# Altium schematic sheet 01.Main.SchDoc
size A
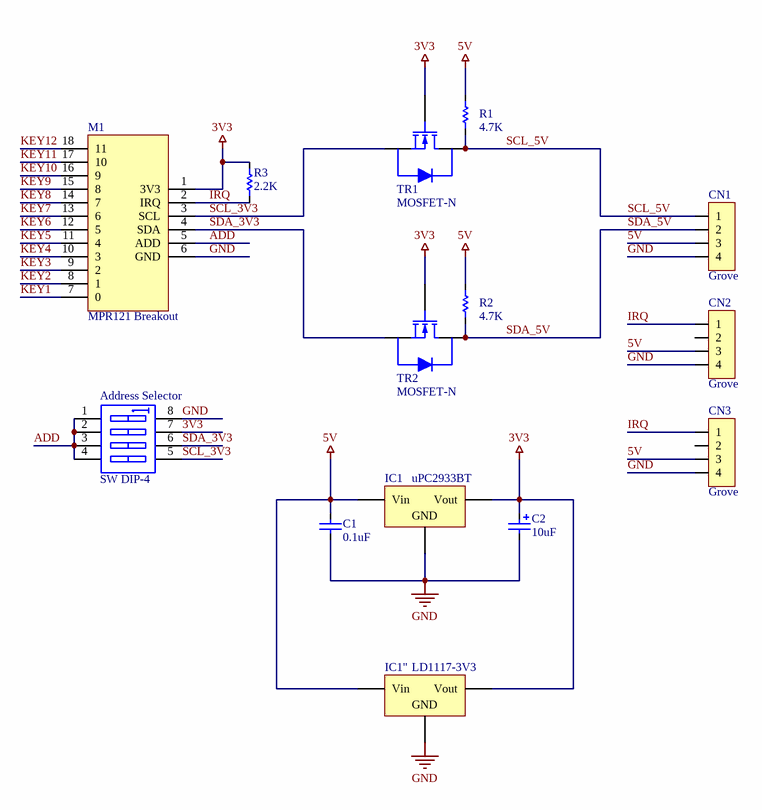
[diagram p0: 01.Main.SchDoc]

## Parts
Address_Selector  SW DIP-4  [DIP-8]
C1  0.1uF  [Cap NP 5mm]
C2  10uF  [Cap 5mm]
CN1  Grove  [Grove-4P-180D]
CN2  Grove  [Grove-4P-180D]
CN3  Grove  [Grove-4P-180D]
IC1  uPC2933BT  [D2PAK_M]
IC1"  LD1117-3V3  [sot223_M]
M1  MPR121 Breakout  [MPR121 Breakout]
R1  4.7K  [Res 1/4W]
R2  4.7K  [Res 1/4W]
R3  2.2K  [0805]
TR1  MOSFET-N  [to-92]
TR2  MOSFET-N  [to-92]

## Nets
3V3: Address_Selector.7(B2) C2.1 IC1.Vout IC1".Vout M1.1(3V3) R3.2 TR1.2(G) TR2.2(G)
5V: C1.2 CN1.3 CN2.3 CN3.3 IC1.Vin IC1".Vin R1.2 R2.2
GND: Address_Selector.8(B1) C1.1 C2.2 CN1.4 CN2.4 CN3.4 IC1.GND IC1".GND M1.6(GND)
ADD: Address_Selector.1(A1) Address_Selector.2(A2) Address_Selector.3(A3) Address_Selector.4(A4) M1.5(ADD)
IRQ: CN2.1 CN3.1 M1.2(IRQ) R3.1
KEY1: M1.7(0)
KEY2: M1.8(1)
KEY3: M1.9(2)
KEY4: M1.10(3)
KEY5: M1.11(4)
KEY6: M1.12(5)
KEY7: M1.13(6)
KEY8: M1.14(7)
KEY9: M1.15(8)
KEY10: M1.16(9)
KEY11: M1.17(10)
KEY12: M1.18(11)
SCL_3V3: Address_Selector.5(B4) M1.3(SCL) TR1.1(S)
SCL_5V: CN1.1 R1.1 TR1.3(D)
SDA_3V3: Address_Selector.6(B3) M1.4(SDA) TR2.1(S)
SDA_5V: CN1.2 R2.1 TR2.3(D)

Not connected (* = marked no-connect by the designer): CN2 2; CN3 2

## Library data of the parts
Address_Selector = SW DIP-4: DIP Switch, 4 Position, SPST; Published: 24-Mar-1999; LatestRevisionDate: 29-May-2009; LatestRevisionNote: IPC-7351 Footprint Added.; PackageVersion: Dec-2002; PackageReference: SO8; Publisher: Altium Limited; PackageDescription: 8-Pin Small Outline Integrated Circuit 1.27 mm Pitch; Code_JEDEC: MS-012-AA; Code_IPC: SOIC127P600-8
C1 = Capacitor Non-Polar
C2 = Capacitor Polar
CN1-CN3 = Connector 1X4
IC1 IC1" = Volt Reg_1: Voltage Regulator; Published: 24-Mar-1999; LatestRevisionDate: 29-May-2009; LatestRevisionNote: IPC-7351 Footprint Added.; PackageReference: D2PAK; Publisher: Altium Limited; PackageDescription: 3-Pin Transistor Outline Package 2.54 mm Pitch, 15.1 mm Lead Span
R1-R3 = Resistor
TR1 TR2 = MOSFET-N: N-Channel MOSFET; Published: 8-Jun-2000; LatestRevisionDate: 17-Jul-2002; LatestRevisionNote: Re-released for DXP Platform.; PackageVersion: 1995/1996; PackageReference: E3; Publisher: Altium Limited; PackageDescription: TO, Flat Index; 3 In-Line, Axial Leads; Body Dia. 4.6mm; Lead Dia. 0.5 mm (max)